# EAGLE schematic schema drive basics (EAGLE 9.6.0)
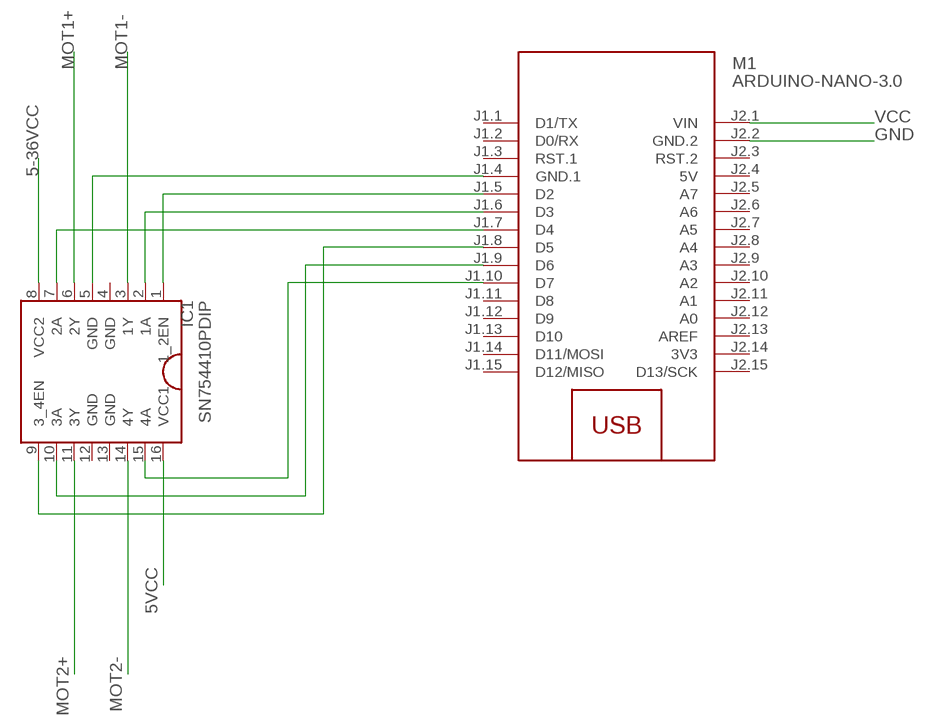
[diagram p0: schematic, sheet 1]

## Parts
IC1  SN754410PDIP  [DIL16]
M1  ARDUINO-NANO-3.0  [ARDUINO-NANO-3.0]

## Nets
5-36VCC: IC1.8(VCC2)
5VCC: IC1.16(VCC1)
GND: M1.J2.2(GND.2)
MOT1+: IC1.6(2Y)
MOT1-: IC1.3(1Y)
MOT2+: IC1.11(3Y)
MOT2-: IC1.14(4Y)
N$1: IC1.1(1_2EN) M1.J1.5(D2)
N$2: IC1.2(1A) M1.J1.6(D3)
N$3: IC1.7(2A) M1.J1.7(D4)
N$4: IC1.9(3_4EN) M1.J1.8(D5)
N$5: IC1.10(3A) M1.J1.9(D6)
N$6: IC1.15(4A) M1.J1.10(D7)
N$7: IC1.5(GND) M1.J1.4(GND.1)
VCC: M1.J2.1(VIN)
Unconnected: IC1.4(GND) IC1.12(GND) IC1.13(GND) M1.J1.1(D1/TX) M1.J1.2(D0/RX) M1.J1.3(RST.1) M1.J1.11(D8) M1.J1.12(D9) M1.J1.13(D10) M1.J1.14(D11/MOSI) M1.J1.15(D12/MISO) M1.J2.3(RST.2) M1.J2.5(A7) M1.J2.6(A6) M1.J2.7(A5) M1.J2.8(A4) M1.J2.9(A3) M1.J2.10(A2) M1.J2.11(A1) M1.J2.12(A0) M1.J2.13(AREF) M1.J2.15(D13/SCK)

## Power pins joined to a net without a drawn wire
3V3: M1.J2.14(3V3)
5V: M1.J2.4(5V)

## Library data of the parts
IC1 = AlexW-Eagle-Libraries:SN754410
M1 = diy-modules:ARDUINO-NANO-3.0: Arduino Nano 3.0 and compatible devices More details available here: https://www.arduino.cc/en/Main/ArduinoBoardNano Click here to find device on ebay.com <http://www.ebay.com/sch/arduino+nano>